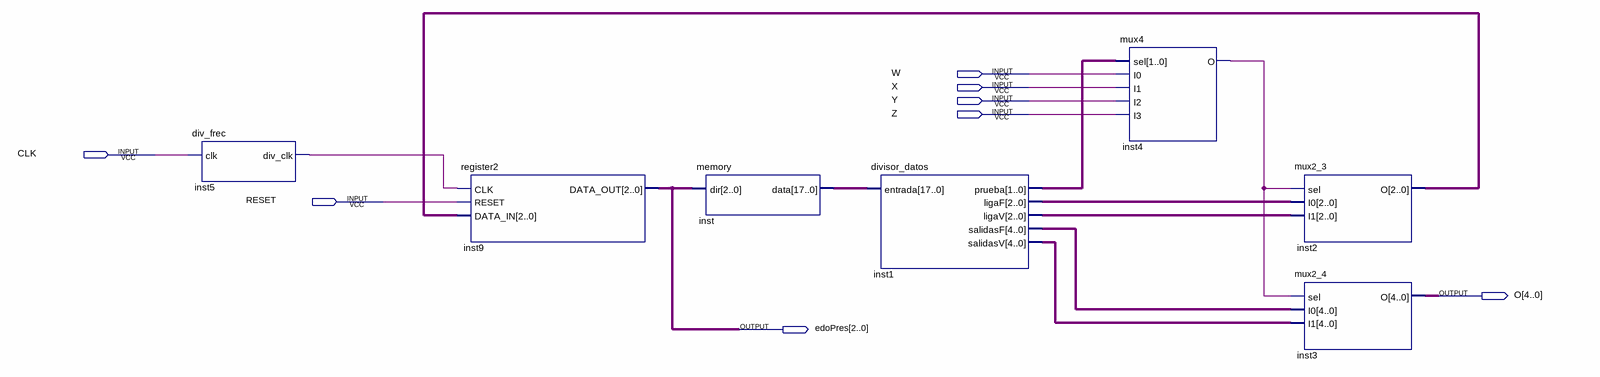
[diagram p0: schematic sheet]
// Quartus schematic practica4_fpga.bdf as structural Verilog: 7 symbols, 8 pins
module practica4_fpga (
  input  W,
  input  X,
  input  Y,
  input  Z,
  input  CLK,
  input  RESET,
  output [4:0] O,
  output [2:0] edoPres
);

  wire inst4_o, inst5_div_clk;
  wire [1:0] inst1_prueba;
  wire [2:0] inst1_ligaf, inst1_ligav, inst2_o;
  wire [4:0] inst1_salidasf, inst1_salidasv;
  wire [17:0] inst_data;

  div_frec inst5 (.clk(CLK), .div_clk(inst5_div_clk));
  register2 inst9 (.CLK(inst5_div_clk), .RESET(RESET), .DATA_IN(inst2_o), .DATA_OUT(edoPres));
  memory inst (.dir(edoPres), .data(inst_data));
  divisor_datos inst1 (
    .entrada(inst_data), .prueba(inst1_prueba), .ligaF(inst1_ligaf), .ligaV(inst1_ligav),
    .salidasF(inst1_salidasf), .salidasV(inst1_salidasv));
  mux4 inst4 (.sel(inst1_prueba), .I0(W), .I1(X), .I2(Y), .I3(Z), .O(inst4_o));
  mux2_3 inst2 (.sel(inst4_o), .I0(inst1_ligaf), .I1(inst1_ligav), .O(inst2_o));
  mux2_4 inst3 (.sel(inst4_o), .I0(inst1_salidasf), .I1(inst1_salidasv), .O(O));
endmodule
